# Altium schematic sheet IHM_Schematic.SchDoc: IHM
size A4; DrawnBy: GUILLEMOT Killian; Revision: Rev A; SheetNumber: 2; SheetTotal: 4
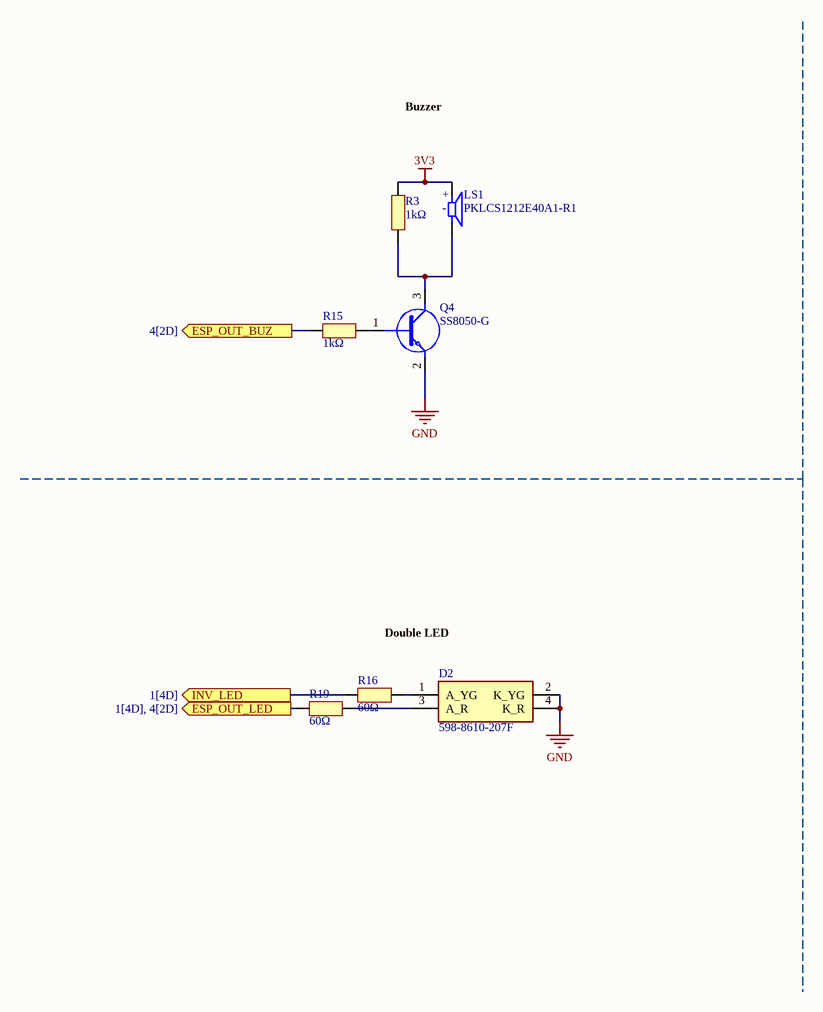
[diagram p0: IHM_Schematic.SchDoc]

## Parts
D2  598-8610-207F  [5988610207F]
LS1  PKLCS1212E40A1-R1  [SPKR_PKLCS1212E40A1-R1]
Q4  SS8050-G  [SS8050-G]
R3  1kΩ  [RESC1005X06N]
R15  1kΩ  [RESC1005X06N]
R16  60Ω  [RESC1005X06N]
R19  60Ω  [RESC1005X06N]

## Ports
ESP_OUT_BUZ (out, see 4[2D]), ESP_OUT_LED (out, see 1[4D], 4[2D]), INV_LED (out, see 1[4D])

## Nets
3V3: LS1.P R3.2
GND: D2.2(K_YG) D2.4(K_R) Q4.2(E)
ESP_OUT_BUZ: R15.2 ; port ESP_OUT_BUZ
ESP_OUT_LED: R19.2 ; port ESP_OUT_LED
INV_LED: R16.1 ; port INV_LED
NetD2_1: D2.1(A_YG) R16.2
NetD2_3: D2.3(A_R) R19.1
NetLS1_N: LS1.N Q4.3(C) R3.1
NetQ4_1: Q4.1(B) R15.1

## Notes on the sheet
- Buzzer
- Double LED
- (in symbol PKLCS1212E40A1-R1) +; -

## Library data of the parts
D2 = 598-8610-207F: Standard LEDs - SMD Red/Green WC 80/50mcd 645/570nm; Manufacturer_Name: Dialight; Geometry.Height: 0.8mm; Manufacturer_Part_Number: 598-8610-207F; Mouser Part Number: 645-598-8610-207F; Mouser Price/Stock: https://www.mouser.co.uk/ProductDetail/Dialight/598-8610-207F?qs=7JStj%2FjQ2SFuCjosqwklHQ%3D%3D; Arrow Part Number: 598-8610-207F; Arrow Price/Stock: https://www.arrow.com/en/products/598-8610-207f/dialight?region=nac; Datasheet Link: https://media.digikey.com/pdf/Data%20Sheets/Dialight%20PDFs/598%20Series%201210%20Pkg%20Bi-Color.pdf
LS1 = PKLCS1212E40A1-R1: Buzzers Transducer, Externally Driven Piezo 1.5V 2kHz 70dB @ 1.5V, 10cm Surface Mount Solder Pads; MF: Murata Electronics; Value: *; MP: PKLCS1212E40A1-R1; Package: None; Availability: Unavailable; Price: None
Q4 = SS8050-G: Bipolar Transistors - BJT NPN TRANSISTOR 1.5A 40V
R3 R15 R16 R19 = Resistor